# Altium schematic sheet SHT_2_Power_07349-R5_L10.SchDoc
size B; CompanyName: Microchip Technology Inc.; DrawnBy: Roger Hathaway; Organization: Microchip Technology; Address1: 2355 West Chandler Blvd.; Address2: Chandler, AZ  85224; Address4: USA; SheetNumber: 2; SheetTotal: 9; SheetTitle: Input Source Select and Power Supplies; Time: Time; ProjectName: OMEGA - L10
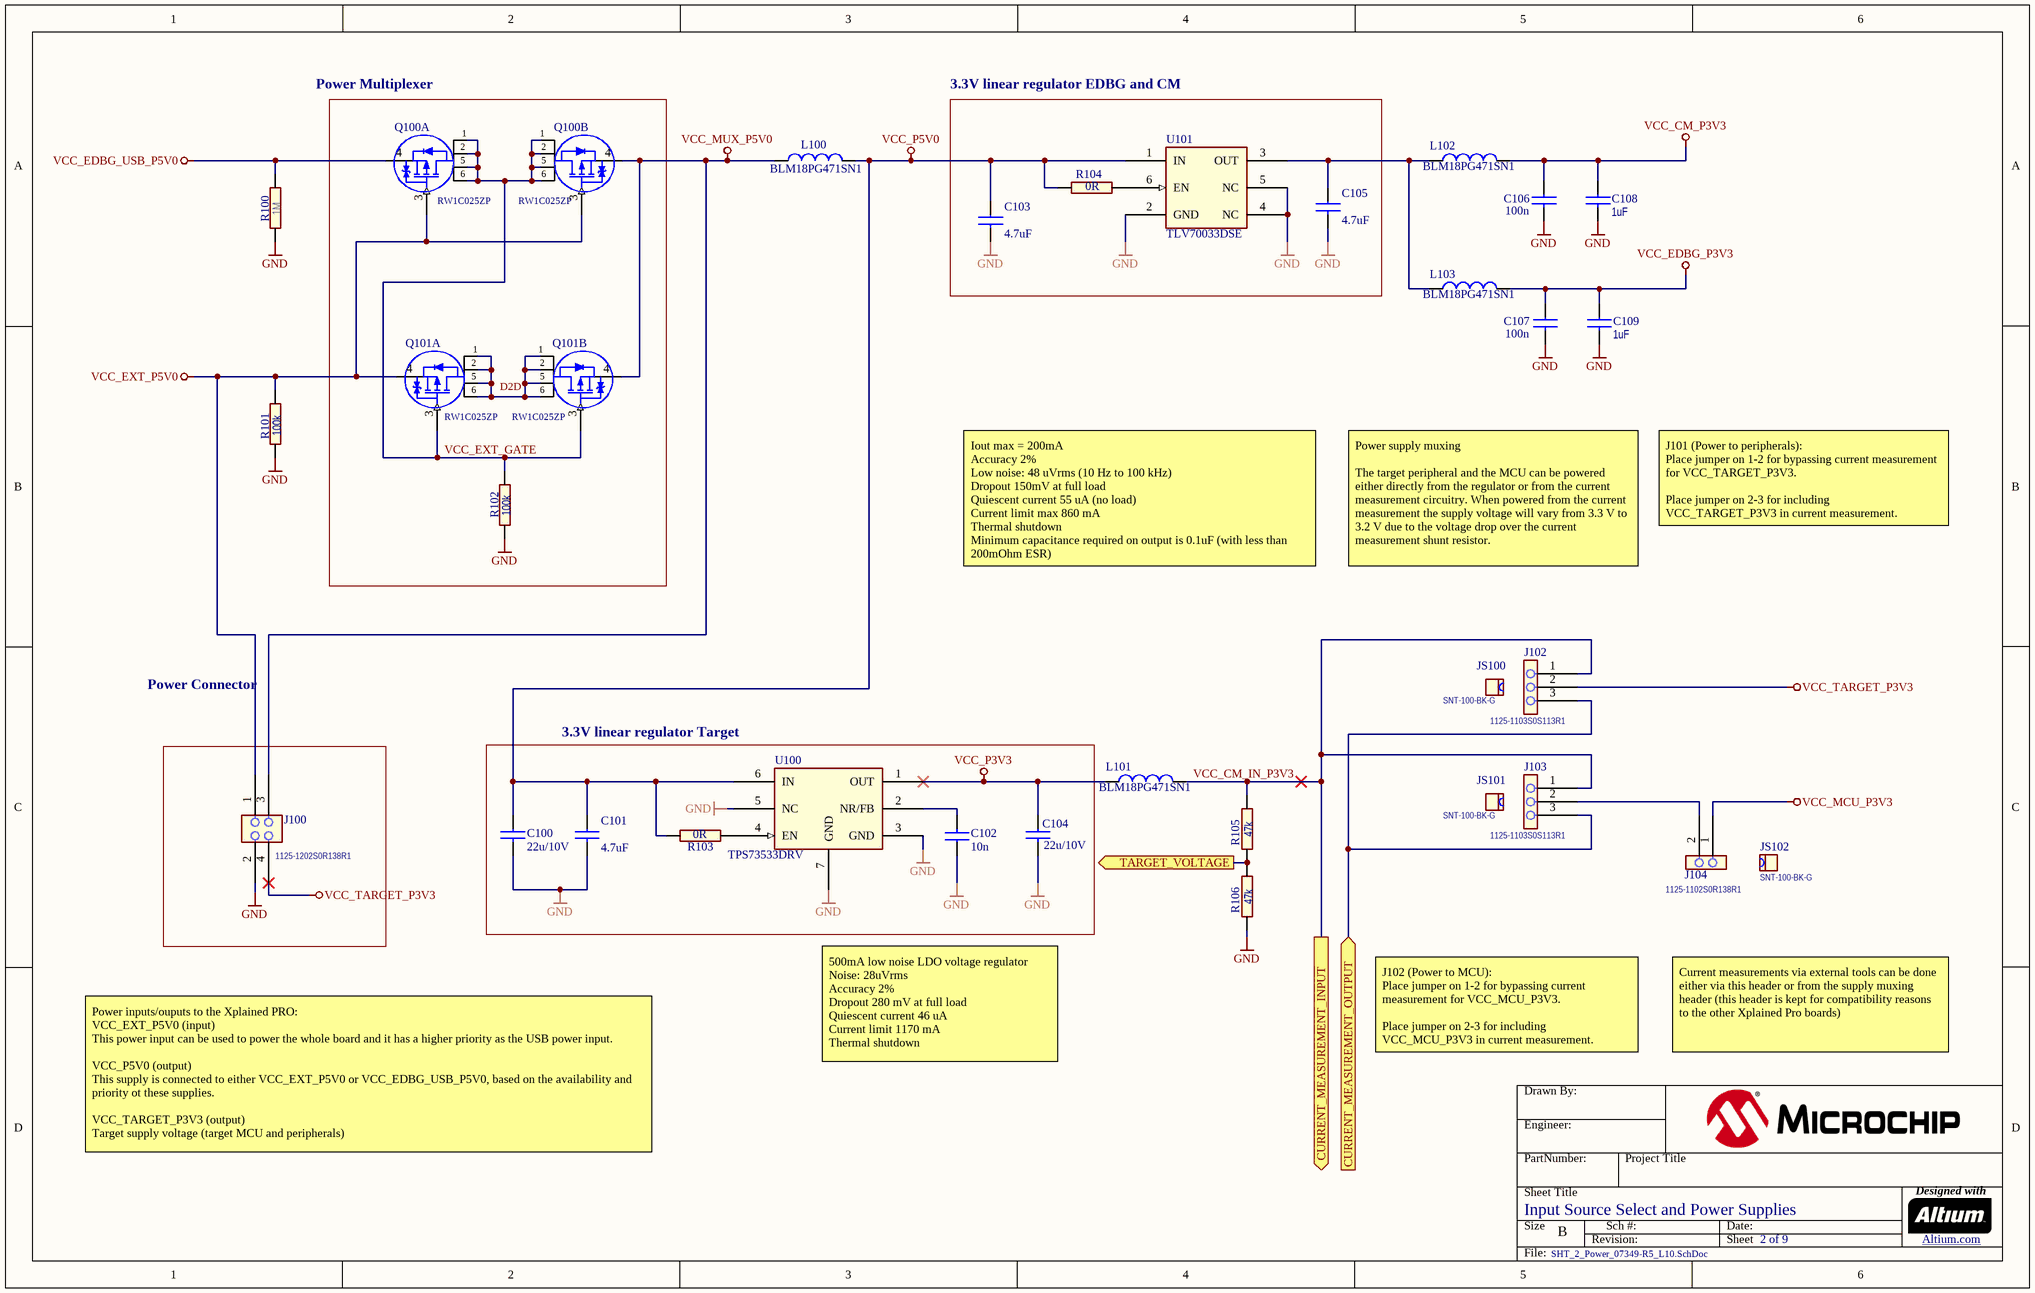
[diagram p0: SHT_2_Power_07349-R5_L10.SchDoc]

## Parts
?  (no value)  (graphical)
C100  value 22u/10V  [AP1-00003]
C101  value 4.7uF  [AP1-00117]
C102  value 10n  [AP1-00053]
C103  value 4.7uF  [AP1-00117]
C104  value 22u/10V  [AP1-00003]
C105  value 4.7uF  [AP1-00117]
C106  value 100n  [AP1-00053]
C107  value 100n  [AP1-00053]
C108  value 1uF  [AP1-00002]  (hidden comment: CAP-NONPOL)
C109  value 1uF  [AP1-00002]  (hidden comment: CAP-NONPOL)
J100  value 1125-1202S0R138R1  [AP8-01076]  (hidden comment: HEADER 2x2)
J102  value 1125-1103S0S113R1  [AP8-01075]  (hidden comment: HEADER 1x3)
J103  value 1125-1103S0S113R1  [AP8-01075]  (hidden comment: HEADER 1x3)
J104  MPN: 1125-1102S0R138R1  [AP8-01071]  (hidden comment: Low cost replacement for A08-0764)
JS100  value SNT-100-BK-G  [AP8-00525]  (hidden comment: To be used by request from ESCATEC)
JS101  value SNT-100-BK-G  [AP8-00525]  (hidden comment: To be used by request from ESCATEC)
JS102  value SNT-100-BK-G  [AP8-00525]  (hidden comment: To be used by request from ESCATEC)
L100  value BLM18PG471SN1  [AP3-00005]
L101  value BLM18PG471SN1  [AP3-00005]
L102  value BLM18PG471SN1  [AP3-00005]
L103  value BLM18PG471SN1  [AP3-00005]
Q100A  Manufacturer Part Number: RW1C025ZP  [AP5-00057]  (hidden comment: MOSFET_RW1C025ZP)
Q100B  Manufacturer Part Number: RW1C025ZP  [AP5-00057]  (hidden comment: MOSFET_RW1C025ZP)
Q101A  Manufacturer Part Number: RW1C025ZP  [AP5-00057]  (hidden comment: MOSFET_RW1C025ZP)
Q101B  Manufacturer Part Number: RW1C025ZP  [AP5-00057]  (hidden comment: MOSFET_RW1C025ZP)
R100  value 1M  [AP2-00011]  (hidden comment: *)
R101  value 100k  [AP2-00011]
R102  value 100k  [AP2-00011]
R103  value 0R  [AP2-00011]
R104  value 0R  [AP2-00011]
R105  value 47k  [AP2-00011]
R106  value 47k  [AP2-00011]
U100  value TPS73533DRV  [AP6-00162]
U101  value TLV70033DSE  [AP6-00262]

## Blocks framed on the sheet
3.3V linear regulator EDBG and CM: C103 C105 R104 U101
3.3V linear regulator Target: C100-C102 C104 R103 U100

## Ports
CURRENT_MEASUREMENT_INPUT (out), CURRENT_MEASUREMENT_OUTPUT (in), TARGET_VOLTAGE (out)

## Nets
GND: C100.2 C101.2 C102.1 C103.2 C104.2 C105.2 C106.2 C107.2 C108.2 C109.2 J100.2 R100.2 R101.1 R102.1 R106.1 U100.3(GND) U100.5(NC) U100.7(GND) U101.2(GND) U101.4(NC) U101.5(NC)
VCC_CM_P3V3: C106.1 C108.1 L102.2
VCC_EDBG_P3V3: C107.1 C109.1 L103.2
VCC_EDBG_USB_P5V0: Q100A.4(S) R100.1
VCC_EXT_P5V0: J100.1 Q100A.3(G) Q100B.3(G) Q101A.4(S) R101.2
VCC_MCU_P3V3: J104.1
VCC_MUX_P5V0: J100.3 L100.1 Q100B.4(S) Q101B.4(S)
VCC_P3V3: C104.1 L101.2 U100.1(OUT)
VCC_P5V0: C100.1 C101.1 C103.1 L100.2 R103.2 R104.2 U100.6(IN) U101.1(IN)
VCC_TARGET_P3V3: J100.4 J102.2
CURRENT_MEASUREMENT_OUTPUT: J102.3 J103.3 ; port CURRENT_MEASUREMENT_OUTPUT
TARGET_VOLTAGE: R105.1 R106.2 ; port TARGET_VOLTAGE
VCC_CM_IN_P3V3: J102.1 J103.1 L101.1 R105.2 ; port CURRENT_MEASUREMENT_INPUT
VCC_EXT_GATE: Q100A.1(D) Q100A.2(D) Q100A.5(D) Q100A.6(D) Q100B.1(D) Q100B.2(D) Q100B.5(D) Q100B.6(D) Q101A.3(G) Q101B.3(G) R102.2
NetC102_2: C102.2 U100.2(NR/FB)
NetC105_1: C105.1 L102.1 L103.1 U101.3(OUT)
NetJ103_2: J103.2 J104.2
NetQ101A_1: Q101A.1(D) Q101A.2(D) Q101A.5(D) Q101A.6(D) Q101B.1(D) Q101B.2(D) Q101B.5(D) Q101B.6(D)
NetR103_1: R103.1 U100.4(EN)
NetR104_1: R104.1 U101.6(EN)

## Notes on the sheet
- (near Q100A) Power Multiplexer
- Iout max = 200mA
  Accuracy 2%
  Low noise: 48 uVrms (10 Hz to 100 kHz)
  Dropout 150mV at full load
  Quiescent current 55 uA (no load)
  Current limit max 860 mA
  Thermal shutdown
  Minimum capacitance required on output is 0.1uF (with less than 200mOhm ESR)
- Power supply muxing
  The target peripheral and the MCU can be powered either directly from the regulator or from the current measurement circuitry. When powered from the current measurement the supply voltage will vary from 3.3 V to 3.2 V due to the voltage drop over the current measurement shunt resistor.
- J101 (Power to peripherals):
  Place jumper on 1-2 for bypassing current measurement for VCC_TARGET_P3V3.
  Place jumper on 2-3 for including VCC_TARGET_P3V3 in current measurement.
- Power Connector
- J102 (Power to MCU):
  Place jumper on 1-2 for bypassing current measurement for VCC_MCU_P3V3.
  Place jumper on 2-3 for including VCC_MCU_P3V3 in current measurement.
- Current measurements via external tools can be done either via this header or from the supply muxing header (this header is kept for compatibility reasons to the other Xplained Pro boards)
- 500mA low noise LDO voltage regulator
  Noise: 28uVrms
  Accuracy 2%
  Dropout 280 mV at full load
  Quiescent current 46 uA
  Current limit 1170 mA
  Thermal shutdown
- Power inputs/ouputs to the Xplained PRO:
  VCC_EXT_P5V0 (input)
  This power input can be used to power the whole board and it has a higher priority as the USB power input.
  VCC_P5V0 (output)
  This supply is connected to either VCC_EXT_P5V0 or VCC_EDBG_USB_P5V0, based on the availability and priority ot these supplies.
  VCC_TARGET_P3V3 (output)
  Target supply voltage (target MCU and peripherals)
- Labels drawn without touching a wire or pin: D2D
- Drawn By:
- Engineer:
- PartNumber:
- Project Title
- Sheet Title
- Size
- B
- Revision:
- Sch #:
- Date:
- Sheet
- Designed with
- Altium.com <http://go.altium.com/MicrochipLandingPage_Evaluation.html>
- File:

## Library data of the parts
? = Title Block B
C100 C104 = A01-0500: Ceramic capacitor, SMD 0805, X5R, 10V, Â±20%; PartGroup: Capacitors,Ceramic,SMD 0805; Manufacturer: tdk; MPN: C2012X5R1A226M/0.85; TemperatureRange: -55Â°C to +85Â°C; ComponentStatus: 'Active (verified)'; Status: Active; Verified by: Lars Helge Mo; Verified date: 2005-12-15; AN: A01-0500; Height: 0.949999988079071; FootprintStatus: 'Active (Verified)'
C101 C103 C105 = A01-0377: Ceramic capacitor, SMD 0603, X5R, 10V, 10% (de31036); PartGroup: Capacitors,Ceramic,SMD 0603; Manufacturer: tdk; MPN: C1608X5R1A475K; TemperatureRange: -55 - +85 deg C; ComponentStatus: 'Active (verified)'; Status: Active; Verified by: Lars Helge Mo; Verified date: 2005-12-15; AN: A01-0377; Tolerance: 10%; Height: 0.800000011920929; FootprintStatus: 'Active (Verified)'
C102 = A01-0050: Ceramic capacitor, SMD 0402, X7R, 25V, +/-10%; PartGroup: Capacitors,Ceramic,SMD 0402; Manufacturer: YAGEO CORP; MPN: CC0402KRX7R8BB103; TemperatureRange: -55 - +125 deg C; ComponentStatus: 'Active (verified)'; Status: Active; Verified by: Lars Helge Mo; Verified date: 2005-12-15; AN: A01-0050; Tolerance: 25V, +/-10%; Height: 0,550000011920929; FootprintStatus: 'Active (Verified)'
C106 C107 = A01-0246: Ceramic capacitor, SMD 0402, X7R, 16V, +/-10%; PartGroup: Capacitors,Ceramic,SMD 0402; Manufacturer: Kemet; MPN: C0402C104K4RACTU; TemperatureRange: -55 - +125 deg C; ComponentStatus: 'Active (verified)'; Status: Active; Verified by: Lars Helge Mo; Verified date: 2005-12-15; AN: A01-0246; Tolerance: 16V, +/-10%; Height: 0.5; FootprintStatus: 'Active (Verified)'
C108 C109 = A01-0368: Ceramic capacitor, SMD 0603, X5R, 25V, ±10%; PartGroup: Capacitors,Ceramic,SMD 0603; Manufacturer: Murata; MPN: GRM188R61E105K; ComponentStatus: 'Active (verified)'; Status: Active; Verified by: Lars Helge Mo; Verified date: 2005-12-15; AN: A01-0368; Tolerance: ±10%; Height: 0.800000011920929; FootprintStatus: 'Active (Verified)'
J100 = A08-2784: Pin header, 2x2, Right Angle, 2.54mm, THT, Pin In Paste; PartGroup: Mechanical devices,Connectors,Pin headers; Manufacturer: WCON HARDWARE ELECTRONICS CO., LTD; TemperatureRange: -40Â°C to +105Â°C; ComponentStatus: 'Active (verified)'; Verified date: 2005-12-19; Verified by: Lars Helge Mo; Status: Active; AN: A08-2784; Height: 5.15000009536743; MPN: 1125-1202S0R138R1; FootprintStatus: 'Active (Verified)'
J102 J103 = A08-2783: 1x3 pin header, 2.54mm pitch, Pin-in-Paste THM; PartGroup: Mechanical devices,Connectors,Pin headers; Manufacturer: WCON HARDWARE ELECTRONICS CO., LTD; TemperatureRange: -40Â°C to +105Â°C; ComponentStatus: 'Active (verified)'; Verified date: 2006-01-30; Verified by: Lars Helge Mo; Status: Active; AN: A08-2783; Height: 9; MPN: 1125-1103S0S113R1; FootprintStatus: 'Active (Verified)'
J104 = A08-2775: 1x2 pin header, right angle, 2.54 mm pitch, through-hole; PartGroup: Mechanical devices,Connectors,Pin headers; Manufacturer: WCON HARDWARE ELECTRONICS CO., LTD; Value: Pin header 1x2 right angle; ComponentStatus: 'Active (verified)'; Verified date: 2006-01-30; Verified by: Lars Helge; Status: Active; AN: A08-2775; Height: 2.65000009536743; FootprintStatus: 'Active (Verified)'
JS100-JS102 = A08-0543: Jumper cap for 2.54mm pinheader; PartGroup: Mechanical devices,Mounting accessories,Other; Manufacturer: SAMTEC; ComponentStatus: 'Active (verified)'; Verified date: 2006-04-05; Verified by: Lars Helge Mo; Status: Active; AN: A08-0543; MPN: SNT-100-BK-G; FootprintStatus: 'Active (Verified)'
L100-L103 = A03-0035: SMD RF inductor 0603. Z=470Ohm (@100MHz), Max R(dc)=0.65Ohm, Max current=1A; PartGroup: Inductors,EMI; Manufacturer: Murata; Tolerance: ±25%; TemperatureRange: -55°C to +125°C; ComponentStatus: 'Active (verified)'; Verified date: 2006-01-30; Verified by: Lars Helge Mo; Status: Active; AN: A03-0035; Height: 0.800000011920929; MPN: BLM18PG471SN1; FootprintStatus: 'Active (Verified)'
Q100A Q100B Q101A Q101B = A05-0181: Pch -20V -2.5A Small Signal MOSFET; Manufacturer: ROHM; PartGroup: Transistors,Power FET,SMD; FET Type: MOSFET P-Channel; Drain to Source Voltage (Vdss): 20V; Rds On (Max) @ Id, Vgs: 65 mOhm @ -2.5A, - 4.5V; Vgs(th) (Max) @ Id: -1V @ -1mA; Power - Max: 700mW; TemperatureRange: -55 to +150; ComponentStatus: 'Active (verified)'; RoHS: RoHS Compliant; Mounting Type: Surface Mount; Package / Case: SOT-563T; MPN: RW1C025ZP; AN: A05-0181; Value: RW1C025ZP; Height: 0.649999976158142; FootprintStatus: 'Active (Verified)'
R100 = A02-0846: Thick film resistror, SMD 0402, 1/16W, 1%; PartGroup: Resistors,SMD,0402 1%; Manufacturer: YAGEO CORP; MPN: RC0402FR-071ML; TemperatureRange: -55 to +155 deg C; ComponentStatus: 'Active (verified)'; Status: Active; Verified by: Lars Helge Mo; Verified date: 2005-12-19; AN: A02-0846; Tolerance: 1%; Height: 0.349999994039536; FootprintStatus: 'Active (Verified)'
R101 R102 = A02-0260: Thick film resistor, SMD 0402, 1/16W, 1%; PartGroup: Resistors,SMD,0402 1%; Manufacturer: ASJ; MPN: CR10-1003-FK; TemperatureRange: -55ï¿½ to +125ï¿½C; ComponentStatus: 'Active (verified)'; Status: Active; Verified by: Lars Helge Mo; Verified date: 2005-12-19; AN: A02-0260; Tolerance: 1 %; Height: 0.349999994039536; FootprintStatus: 'Active (Verified)'
R103 R104 = A02-0163: RES 0.0 OHM 1/16W 0402 SMD; PartGroup: Resistors,SMD,0402 1%; Manufacturer: (n/a); MPN: RMCF0402ZT0R00; Tolerance: 1 %; TemperatureRange: -55 - +125 deg C; ComponentStatus: 'Active (verified)'; Status: Active; Verified by: Lars Helge Mo; Verified date: 2005-12-19; AN: A02-0163; Height: 0.349999994039536; FootprintStatus: 'Active (Verified)'
R105 R106 = A02-0252: Thick film resistor, SMD 0402, 1/16W, 1%; PartGroup: Resistors,SMD,0402 1%; Manufacturer: KOA; MPN: RK73H1ETTP4702F; TemperatureRange: -55 - +125 deg C; ComponentStatus: 'Active (verified)'; Placement: YES; Status: Active; Verified by: Lars Helge Mo; Verified date: 2005-12-19; AN: A02-0252; Tolerance: 1 %; Height: 0.349999994039536; FootprintStatus: 'Active (Verified)'
U100 = A06-1135: Low noise LDO, 500 mA, Vout=3.3V, 2% accuracy, IQ=46uA, noise=28uVrms, VIN= 2.7V to 6.5V, Vdo=280mV,stable with low ESR capacitor; PartGroup: Integrated Circuits,Regulators,Linear; Manufacturer: Texas Instruments; ComponentStatus: 'Active (verified)'; AN: A06-1135; Height: 0.75; MPN: TPS73533DRV; FootprintStatus: 'Active (Verified)'
U101 = A06-0719: LDO, 200 mA, Iq=31 uA, Vdo=250mV, Vout=3.3V, VIN= 2 V to 5.5V, SON-6 package; PartGroup: Integrated Circuits,Regulators,Linear; Manufacturer: Texas Instruments; ComponentStatus: 'Active (verified)'; AN: A06-0719; Height: 0.800000011920929; MPN: TLV70033DSE; FootprintStatus: 'Active (Verified)'